# EAGLE design attiny24-mini-2-1 (EAGLE 5.10)
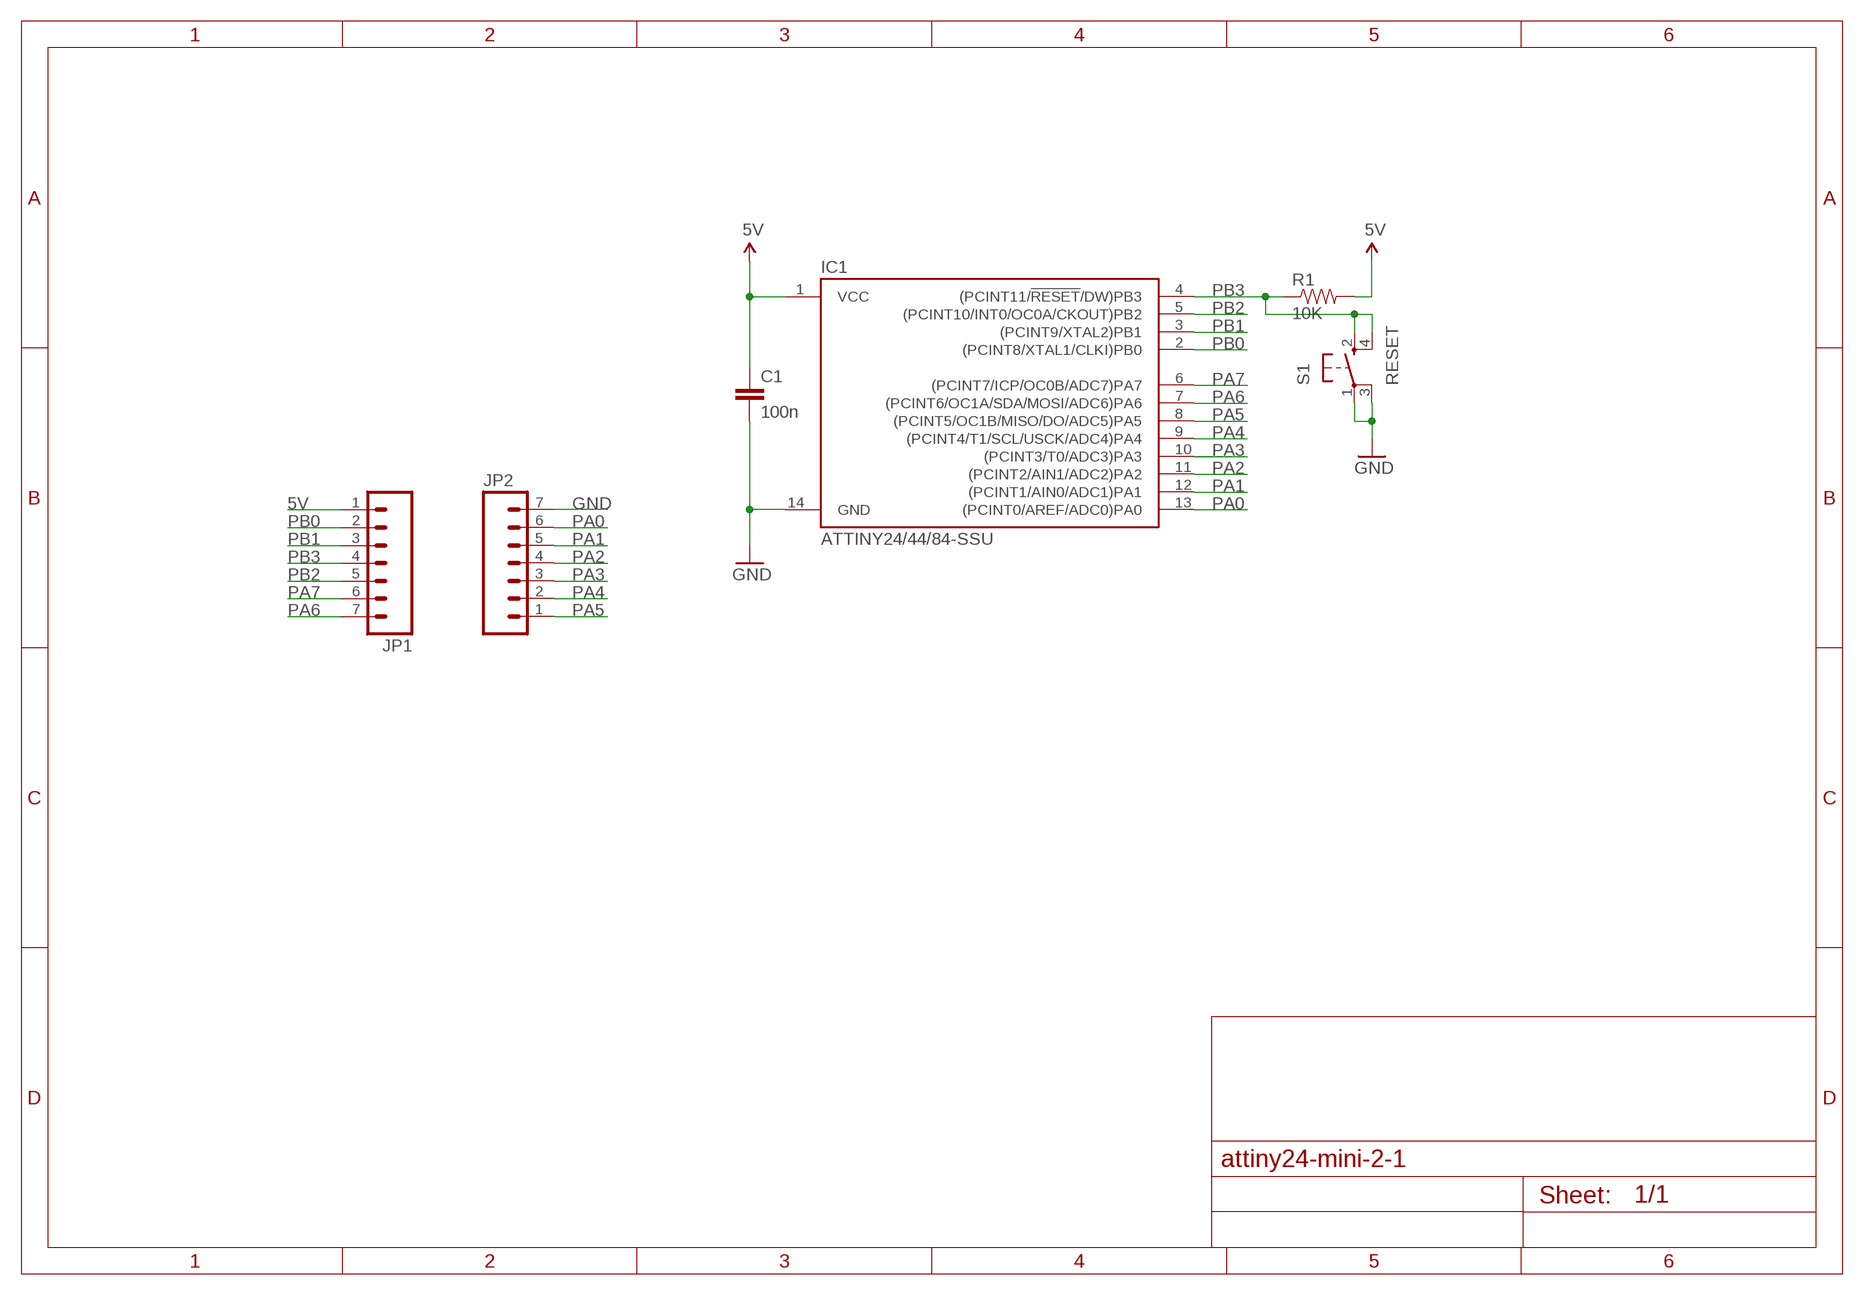
[diagram p0: schematic, sheet 1]

## Parts
C1  100n  CAP0805  [0805]
IC1  ATTINY24/44/84-SSU  [AVR-SOIC14]
JP1  M07  [1X07]
JP2  M07  [1X07]
R1  10K  RESISTOR0805  [0805]
S1  RESET  SWITCH-TACT_SFKHHM  [SWITCH-TACT_SFKHHM]

## Nets
5V [power]: C1.1 IC1.1(VCC) JP1.1 R1.2
GND: C1.2 IC1.14(GND) JP2.7 S1.1 S1.3
PA0: IC1.13((PCINT0/AREF/ADC0)PA0) JP2.6
PA1: IC1.12((PCINT1/AIN0/ADC1)PA1) JP2.5
PA2: IC1.11((PCINT2/AIN1/ADC2)PA2) JP2.4
PA3: IC1.10((PCINT3/T0/ADC3)PA3) JP2.3
PA4: IC1.9((PCINT4/T1/SCL/USCK/ADC4)PA4) JP2.2
PA5: IC1.8((PCINT5/OC1B/MISO/DO/ADC5)PA5) JP2.1
PA6: IC1.7((PCINT6/OC1A/SDA/MOSI/ADC6)PA6) JP1.7
PA7: IC1.6((PCINT7/ICP/OC0B/ADC7)PA7) JP1.6
PB0: IC1.2((PCINT8/XTAL1/CLKI)PB0) JP1.2
PB1: IC1.3((PCINT9/XTAL2)PB1) JP1.3
PB2: IC1.5((PCINT10/INT0/OC0A/CKOUT)PB2) JP1.5
PB3: IC1.4((PCINT11/!RESET!/DW)PB3) JP1.4 R1.1 S1.2 S1.4

## Library data of the parts
C1 = attiny24:CAP: Capacitor Standard 0603 ceramic capacitor, and 0.1" leaded capacitor.
IC1 = attiny24:ATTINY24/44/84
JP1 JP2 = attiny24:M07: Header 7 Standard 7-pin 0.1" header. Use with straight break away headers (SKU : PRT-00116), right angle break away headers (PRT-00553), swiss pins (PRT-00743), machine pins (PRT-00117), and female headers (PRT-00115). NOTES ON THE VARIANTS LOCK and LOCK_LONGPADS... This footprint was designed to help hold the alignment of a through-hole component (i.e. 7-pin header) while soldering it into place. You may notice that each hole has been shifted either up or down by 0.005 of an inch from it's more standard position (which is usually a perfectly straight line). This slight alteration caused the pins (the squares in the middle) to touch the edges of the holes. Because they are alternating, it causes a "brace" to hold the header in place. 0.005 has proven to be the perfect amount of "off-center" position when using our standard breakaway headers. Although looks a little odd when you look at the bare footprint, once you have a header in there, the alteration is very hard to notice. Also, if you push a header all the way into place, it is covered up entirely on the bottom side. This idea of altering the position of holes to aid alignment will be further integrated into the Sparkfun Library for other footprints. It can help hold any component with 3 or more connection pins.
R1 = attiny24:RESISTOR: Resistor Basic schematic elements and footprints for 0402, 0603, 0805, 1206, PTH 1/10th watt (small), 0102, 0204, and etc. resistors.
S1 = attiny24:SWITCH-TACT_SFKHHM: Tact Switch made by Forward, Taiwan. Model No. Prefix SFKHHM

## Net classes
0 default: width 0.305 mm, drill 0.61 mm, clearance 0.203 mm
1 power: width 0.406 mm, drill 0.813 mm, clearance 0.203 mm

## Board
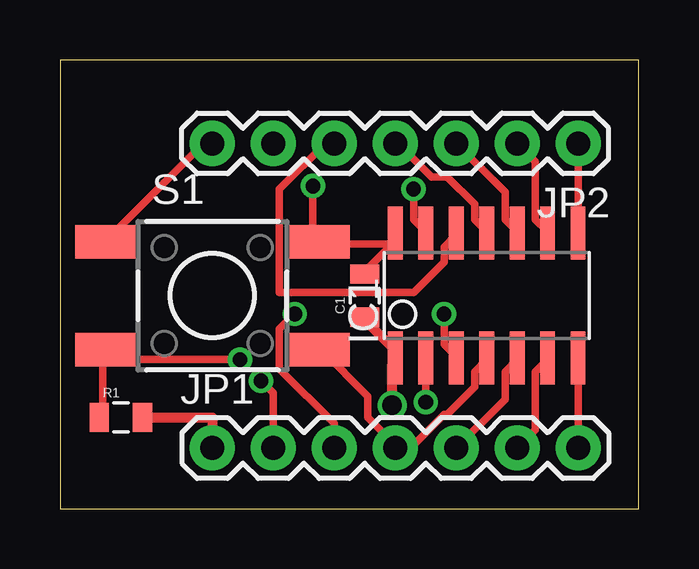
[diagram p1: board, top side]
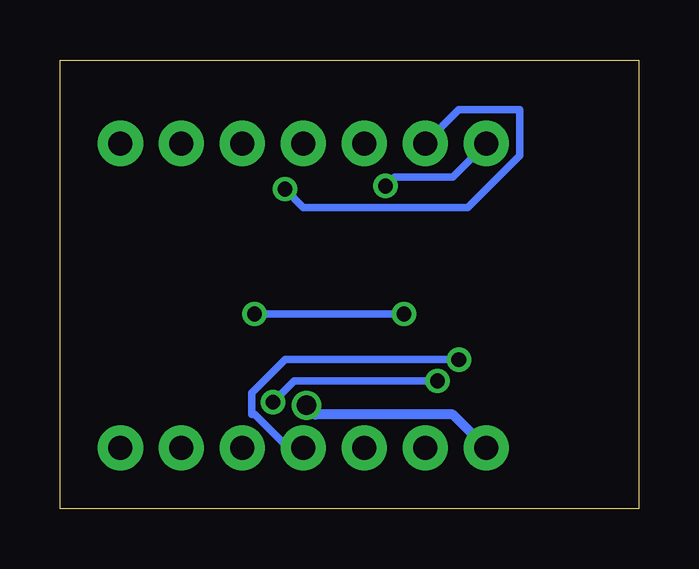
[diagram p2: board, bottom side, seen from below]

Size 24.11 x 18.72 mm. Coordinates in mm from the lower left corner, seen from the top.
Outline: 0,0 24.11,0 24.11,18.72 0,18.72 0,0
Copper layers (1*16): Top 0.035mm / dielectric 1.5mm / Bottom 0.035mm
Design rules "default": minimum track width 10mil, minimum drill 24mil, track to track 8mil, track to pad 8mil, pad to pad 8mil, via to via 8mil, smd to smd 8mil, copper to edge 40mil, drill to drill 8mil, minimum pad ring 10mil, minimum via ring 8mil, stop-mask expansion 4mil, vias tented up to drill 0mil, thermal gap 10mil

### Footprints (pad centres in the part's own frame; a part is rotated, then mirrored left to right if it is on the bottom)
0805 = smd 0.8 x 1.2: 1 -0.9,0; 2 0.9,0
AVR-SOIC14 = smd 0.61 x 2.21: 1 -3.81,-2.603; 2 -2.54,-2.603; 3 -1.27,-2.603; 4 0,-2.603; 5 1.27,-2.603; 6 2.54,-2.603; 7 3.81,-2.603; 8 3.81,2.603; 9 2.54,2.603; 10 1.27,2.603; 11 0,2.603; 12 -1.27,2.603; 13 -2.54,2.603; 14 -3.81,2.603
1X07 = drill 1 pad 1.88 round: 1 0,0; 2 2.54,0; 3 5.08,0; 4 7.62,0; 5 10.16,0; 6 12.7,0; 7 15.24,0
SWITCH-TACT_SFKHHM = smd 2.5 x 1.4: 1 -4.475,2.25; 2 -4.475,-2.25; 3 4.475,2.25; 4 4.475,-2.25

### Placement (x,y rotation side)
C1  12.7,8.89 90 top
IC1  17.78,8.89 0 top
JP1  6.35,2.54 0 top
JP2  21.59,15.24 180 top
R1  2.54,3.81 0 top
S1  6.35,8.89 0 top

### Tracks (layer width: path | path; a pad name or v marks a point on that pad's centre or on a via)
5V  (via drill 0.81)
  Top 0.406: C1.1 12.7,7.87 13.97,6.6 13.97,6.35 IC1.1 13.97,6.1 13.84,5.97 v13.84,4.32 | JP1.1 6.35,3.81 3.56,3.81 R1.2
  Bottom 0.406: v13.84,4.32 13.46,3.94 7.75,3.94 JP1.1
GND  (via drill 0.61)
  Top 0.305: C1.2 12.7,9.91 13.97,11.18 13.97,11.43 IC1.14 13.72,11.05 10.92,11.05 S1.3 10.79,11.18 10.54,11.43 v10.54,13.46 | JP2.7 5.97,15.24 1.91,11.18 S1.1
  Bottom 0.305: v10.54,13.46 10.16,13.84 7.75,13.84 JP2.7
PA0  (via drill 0.61)
  Top 0.305: v14.73,13.34 14.73,12.06 15.24,11.56 IC1.13
  Bottom 0.305: v14.73,13.34 13.97,12.57 7.11,12.57 4.95,14.73 4.95,16.64 7.49,16.64 JP2.6
PA1
  Top 0.305: JP2.5 11.05,15.24 9.14,13.34 9.14,9.02 14.73,9.02 16,10.29 16,10.92 16.51,11.43 IC1.12
PA2
  Top 0.305: JP2.4 14.1,15.24 15.49,13.84 16.13,13.84 17.27,12.7 17.27,12.06 17.78,11.56 IC1.11
PA3
  Top 0.305: JP2.3 18.54,13.21 18.54,12.06 19.05,11.56 IC1.10
PA4
  Top 0.305: JP2.2 19.81,14.48 19.81,12.06 20.32,11.56 IC1.9
PA5
  Top 0.305: JP2.1 21.59,11.56 IC1.8
PA6
  Top 0.305: JP1.7 21.59,6.22 IC1.7
PA7
  Top 0.305: JP1.6 19.81,3.3 19.81,5.71 20.32,6.22 IC1.6
PB0  (via drill 0.61)
  Top 0.305: v15.24,4.45 15.24,6.22 IC1.2 | v8.38,5.33 8.89,4.83 JP1.2
  Bottom 0.305: v15.24,4.45 14.35,5.33 v8.38,5.33
PB1  (via drill 0.61)
  Top 0.305: v16,8.13 16,6.86 16.51,6.35 IC1.3 | v9.78,8.13 9.14,7.49 9.14,5.84 11.43,3.56 JP1.3
  Bottom 0.305: v9.78,8.13 v16,8.13
PB2
  Top 0.305: JP1.5 18.54,4.57 18.54,5.71 19.05,6.22 IC1.5
PB3  (via drill 0.61)
  Top 0.305: R1.1 1.65,3.81 1.78,3.94 1.78,6.6 S1.2 1.91,6.22 v7.49,6.22 | IC1.4 17.78,6.22 17.27,5.71 17.27,5.08 16.13,3.94 16,3.94 14.61,2.54 JP1.4 13.97,2.67 12.83,3.81 12.83,4.7 10.92,6.6 S1.4
  Bottom 0.305: v7.49,6.22 14.73,6.22 16.13,4.83 16.13,3.94 16,3.94 14.61,2.54 JP1.4